# Altium schematic sheet Oscillator_11.0592MHz_Using_HC49S.SchDoc: Oscillator_11.0592MHz_Using_HC49S
size A4
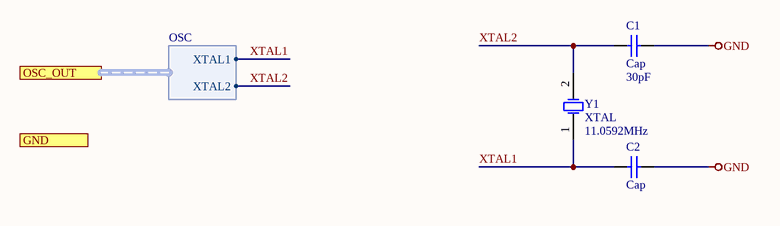
[diagram p0: Oscillator_11.0592MHz_Using_HC49S.SchDoc]

## Parts
C1  Cap  value 30pF  [C0805]
C2  Cap  [C0805]
Y1  XTAL  OscillationFrequency: 11.0592MHz  [XTAL-HC49S-SMD]

## Ports
GND, OSC_OUT (harness OSC)

## Harnesses
OSC: XTAL1, XTAL2

## Nets
GND: C1.2 C2.2
XTAL1: C2.1 Y1.1(OSC1) ; port OSC_OUT.XTAL1
XTAL2: C1.1 Y1.2(OSC2) ; port OSC_OUT.XTAL2

## Library data of the parts
C1 C2 = Cap: Non-Polar Capacitor
Y1 = XTAL_1: Crystal Oscillator